# EAGLE design YaskawaSpeedControl_fix (EAGLE 7.6.0)
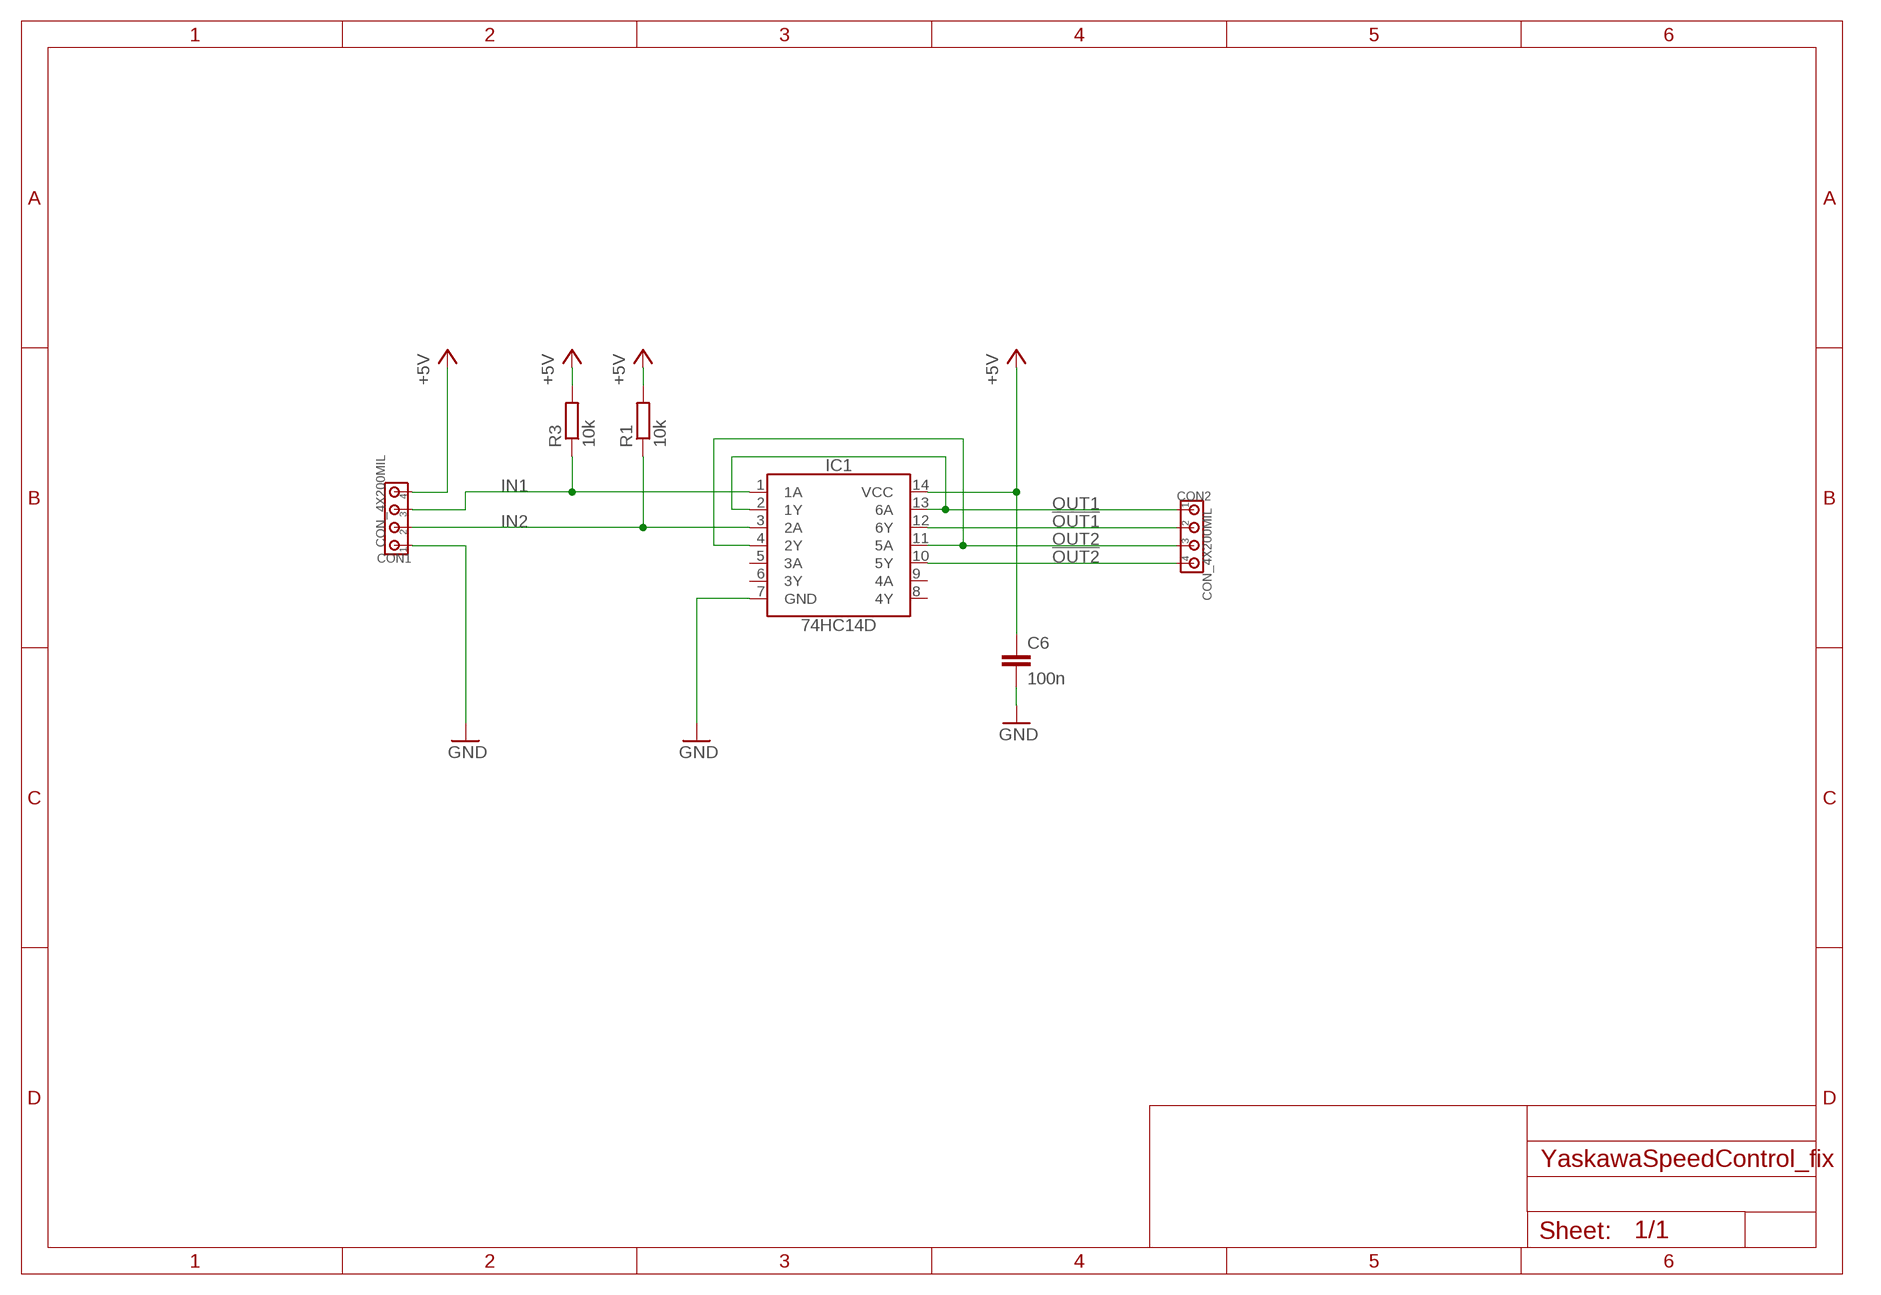
[diagram p0: schematic, sheet 1]

## Parts
C6  100n  CC0805  [C0805]
CON1  CON_4X200MIL  [200MIL_4X]
CON2  CON_4X200MIL  [200MIL_4X]
IC1  74HC14D  [SO14]
R1  10k  RESISTORR0805  [R0805]
R3  10k  RESISTORR0805  [R0805]

## Nets
!OUT1!: CON2.2 IC1.12(6Y)
!OUT2!: CON2.4 IC1.10(5Y)
+5V: C6.1 CON1.4 IC1.14(VCC) R1.2 R3.2
GND: C6.2 CON1.1 IC1.7(GND)
IN1: CON1.3 IC1.1(1A) R3.1
IN2: CON1.2 IC1.3(2A) R1.1
OUT1: CON2.1 IC1.2(1Y) IC1.13(6A)
OUT2: CON2.3 IC1.4(2Y) IC1.11(5A)
Unconnected: IC1.5(3A) IC1.6(3Y) IC1.8(4Y) IC1.9(4A)

## Library data of the parts
C6 = 00Capacitor:C: Capacitor
CON1 CON2 = 00Connector:CON_4X: 4-pin header
IC1 = 00Logic:74HC14: Hex Inverter Schmitt Trigger
R1 R3 = 00Resistor:RESISTOR: RESISTOR, European symbol

## Net classes
1 24V: clearance 0.305 mm

## Board
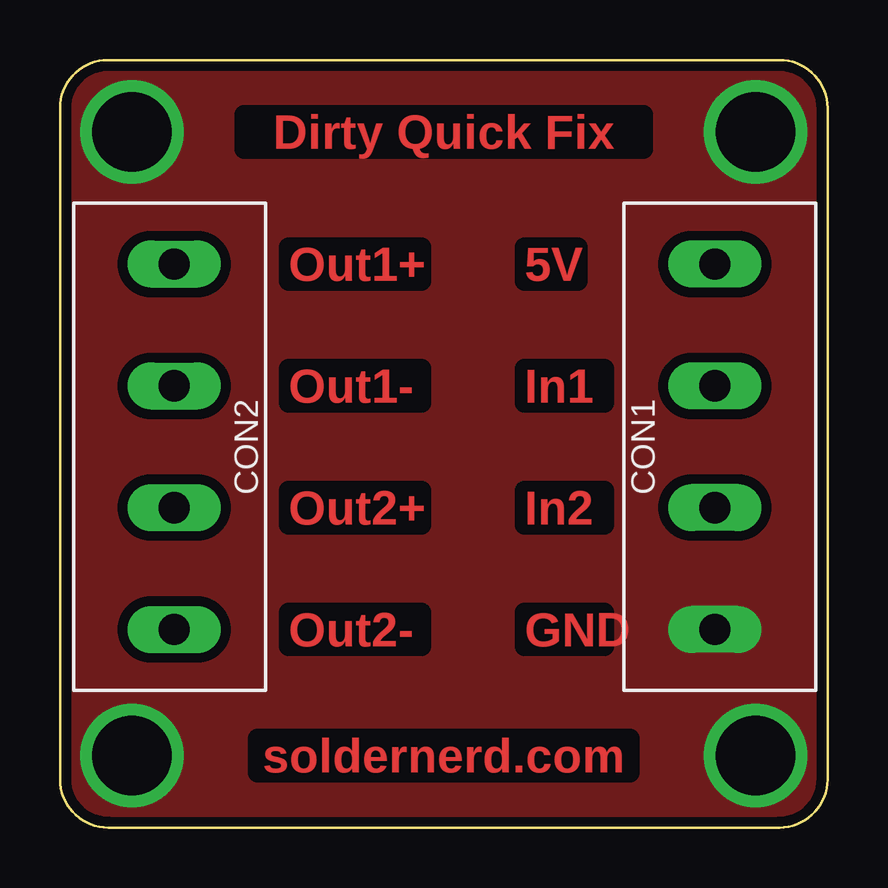
[diagram p1: board, top side]
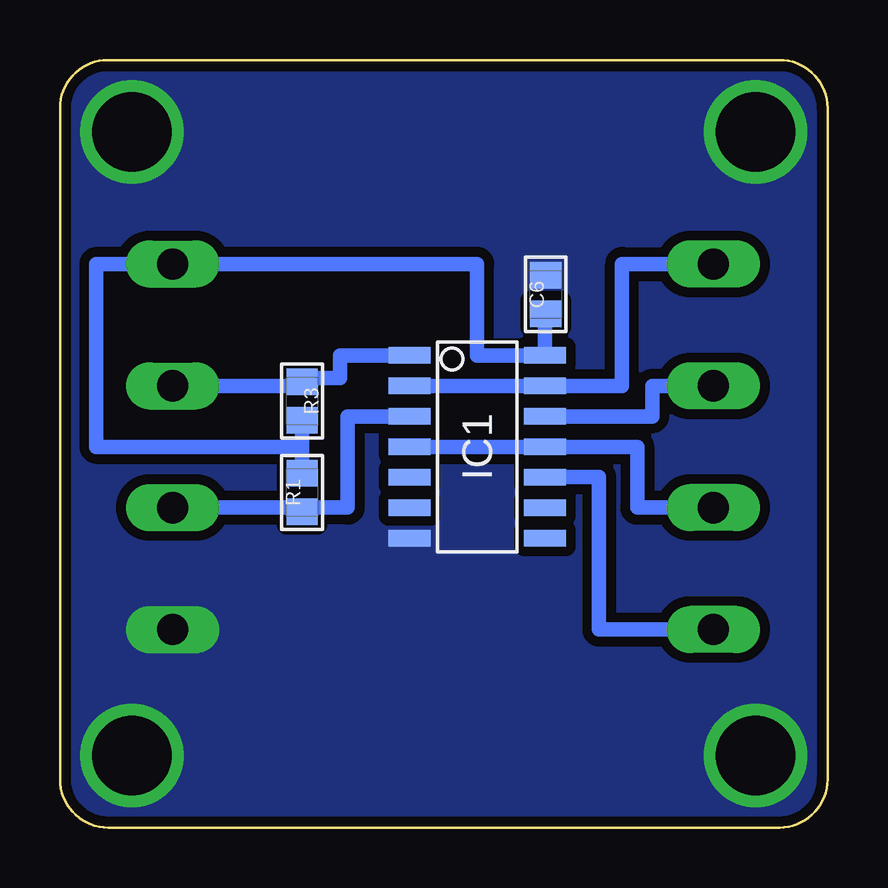
[diagram p2: board, bottom side, seen from below]

Size 32 x 32 mm. Coordinates in mm from the lower left corner, seen from the top.
Outline: 30,0 arc90 32,2 32,30 arc90 30,32 2,32 arc90 0,30 0,2 arc90 2,0 30,0
Copper layers (1*16): Top 0.035mm / dielectric 1.5mm / Bottom 0.035mm
Design rules "LPKF_Compatible": minimum track width 8mil, minimum drill 23mil, track to track 8mil, track to pad 8mil, pad to pad 8mil, via to via 8mil, smd to smd 0mil, copper to edge 10mil, drill to drill 10mil, minimum pad ring 10mil, minimum via ring 10mil, stop-mask expansion 2mil, vias tented up to drill 25mil, thermal gap 10mil

### Footprints (pad centres in the part's own frame; a part is rotated, then mirrored left to right if it is on the bottom)
C0805 = smd 1.1 x 1.3: 1 -0.8,0; 2 0.8,0
200MIL_4X = drill 1.3 long: 1 -7.62,0; 2 -2.54,0; 3 2.54,0; 4 7.62,0
SO14 = smd 0.7 x 1.75: 1 -3.81,-2.825; 2 -2.54,-2.825; 3 -1.27,-2.825; 4 0,-2.825; 5 1.27,-2.825; 6 2.54,-2.825; 7 3.81,-2.825; 8 3.81,2.825; 9 2.54,2.825; 10 1.27,2.825; 11 0,2.825; 12 -1.27,2.825; 13 -2.54,2.825; 14 -3.81,2.825
R0805 = smd 1.1 x 1.3: 1 -0.8,0; 2 0.8,0

### Placement (x,y rotation side)
C6  11.75,22.23 90 bottom
CON1  27.3,15.88 90 top
CON2  4.76,15.88 270 top
IC1  14.61,15.88 270 bottom
R1  21.91,13.97 90 bottom
R3  21.91,17.78 270 bottom

### Tracks (layer width: path | path; a pad name or v marks a point on that pad's centre or on a via)
!OUT1!
  Bottom 0.61: IC1.12 7.3,17.14 7.3,18.41 CON2.2
!OUT2!
  Bottom 0.61: IC1.10 9.53,14.61 9.53,8.26 CON2.4
+5V
  Bottom 0.61: R3.2 21.91,15.88 | 21.91,15.88 R1.2 | 21.91,15.88 30.48,15.88 30.48,23.5 CON1.4 14.61,23.5 14.61,19.68 IC1.14 11.78,21.43 C6.1
GND  (via drill 3.3)
  other vias: 3,29 29,29 3,3 29,3
  pour Bottom (isolate 0.406, rank 3, no thermals): 30,0 2,0 arc-90 0,2 0,30 arc-90 2,32 30,32 arc-90 32,30 32,2 arc-90
  pour Top (isolate 0.406, rank 3, no thermals): 0,2 0,30 arc-90 2,32 30,32 arc-90 32,30 32,2 arc-90 30,0 2,0 arc-90
IN1
  Bottom 0.61: CON1.3 21.91,18.41 R3.1 21.91,18.73 20.32,18.73 20.32,19.68 IC1.1
IN2
  Bottom 0.61: CON1.2 21.91,13.34 | IC1.3 20,17.14 20,13.34 21.91,13.34 | 21.91,13.34 R1.1
OUT1
  Bottom 0.61: IC1.2 IC1.13 8.57,18.41 8.57,23.5 CON2.1
OUT2
  Bottom 0.61: IC1.4 IC1.11 7.94,15.88 7.94,13.34 CON2.3

### Text on the board
Top: Dirty Quick Fix | Out1+ | 5V | Out1- | In1 | Out2+ | In2 | Out2- | GND | soldernerd.com